# EasyEDA schematic SCH_mgts_sensor_node_2026-06-15.json
TITLE: Sheet_1; REV: 1.0; Date: 2026-06-06; Sheet: 1/1; Drawn By: u.s.pat1234; Company: Your Company
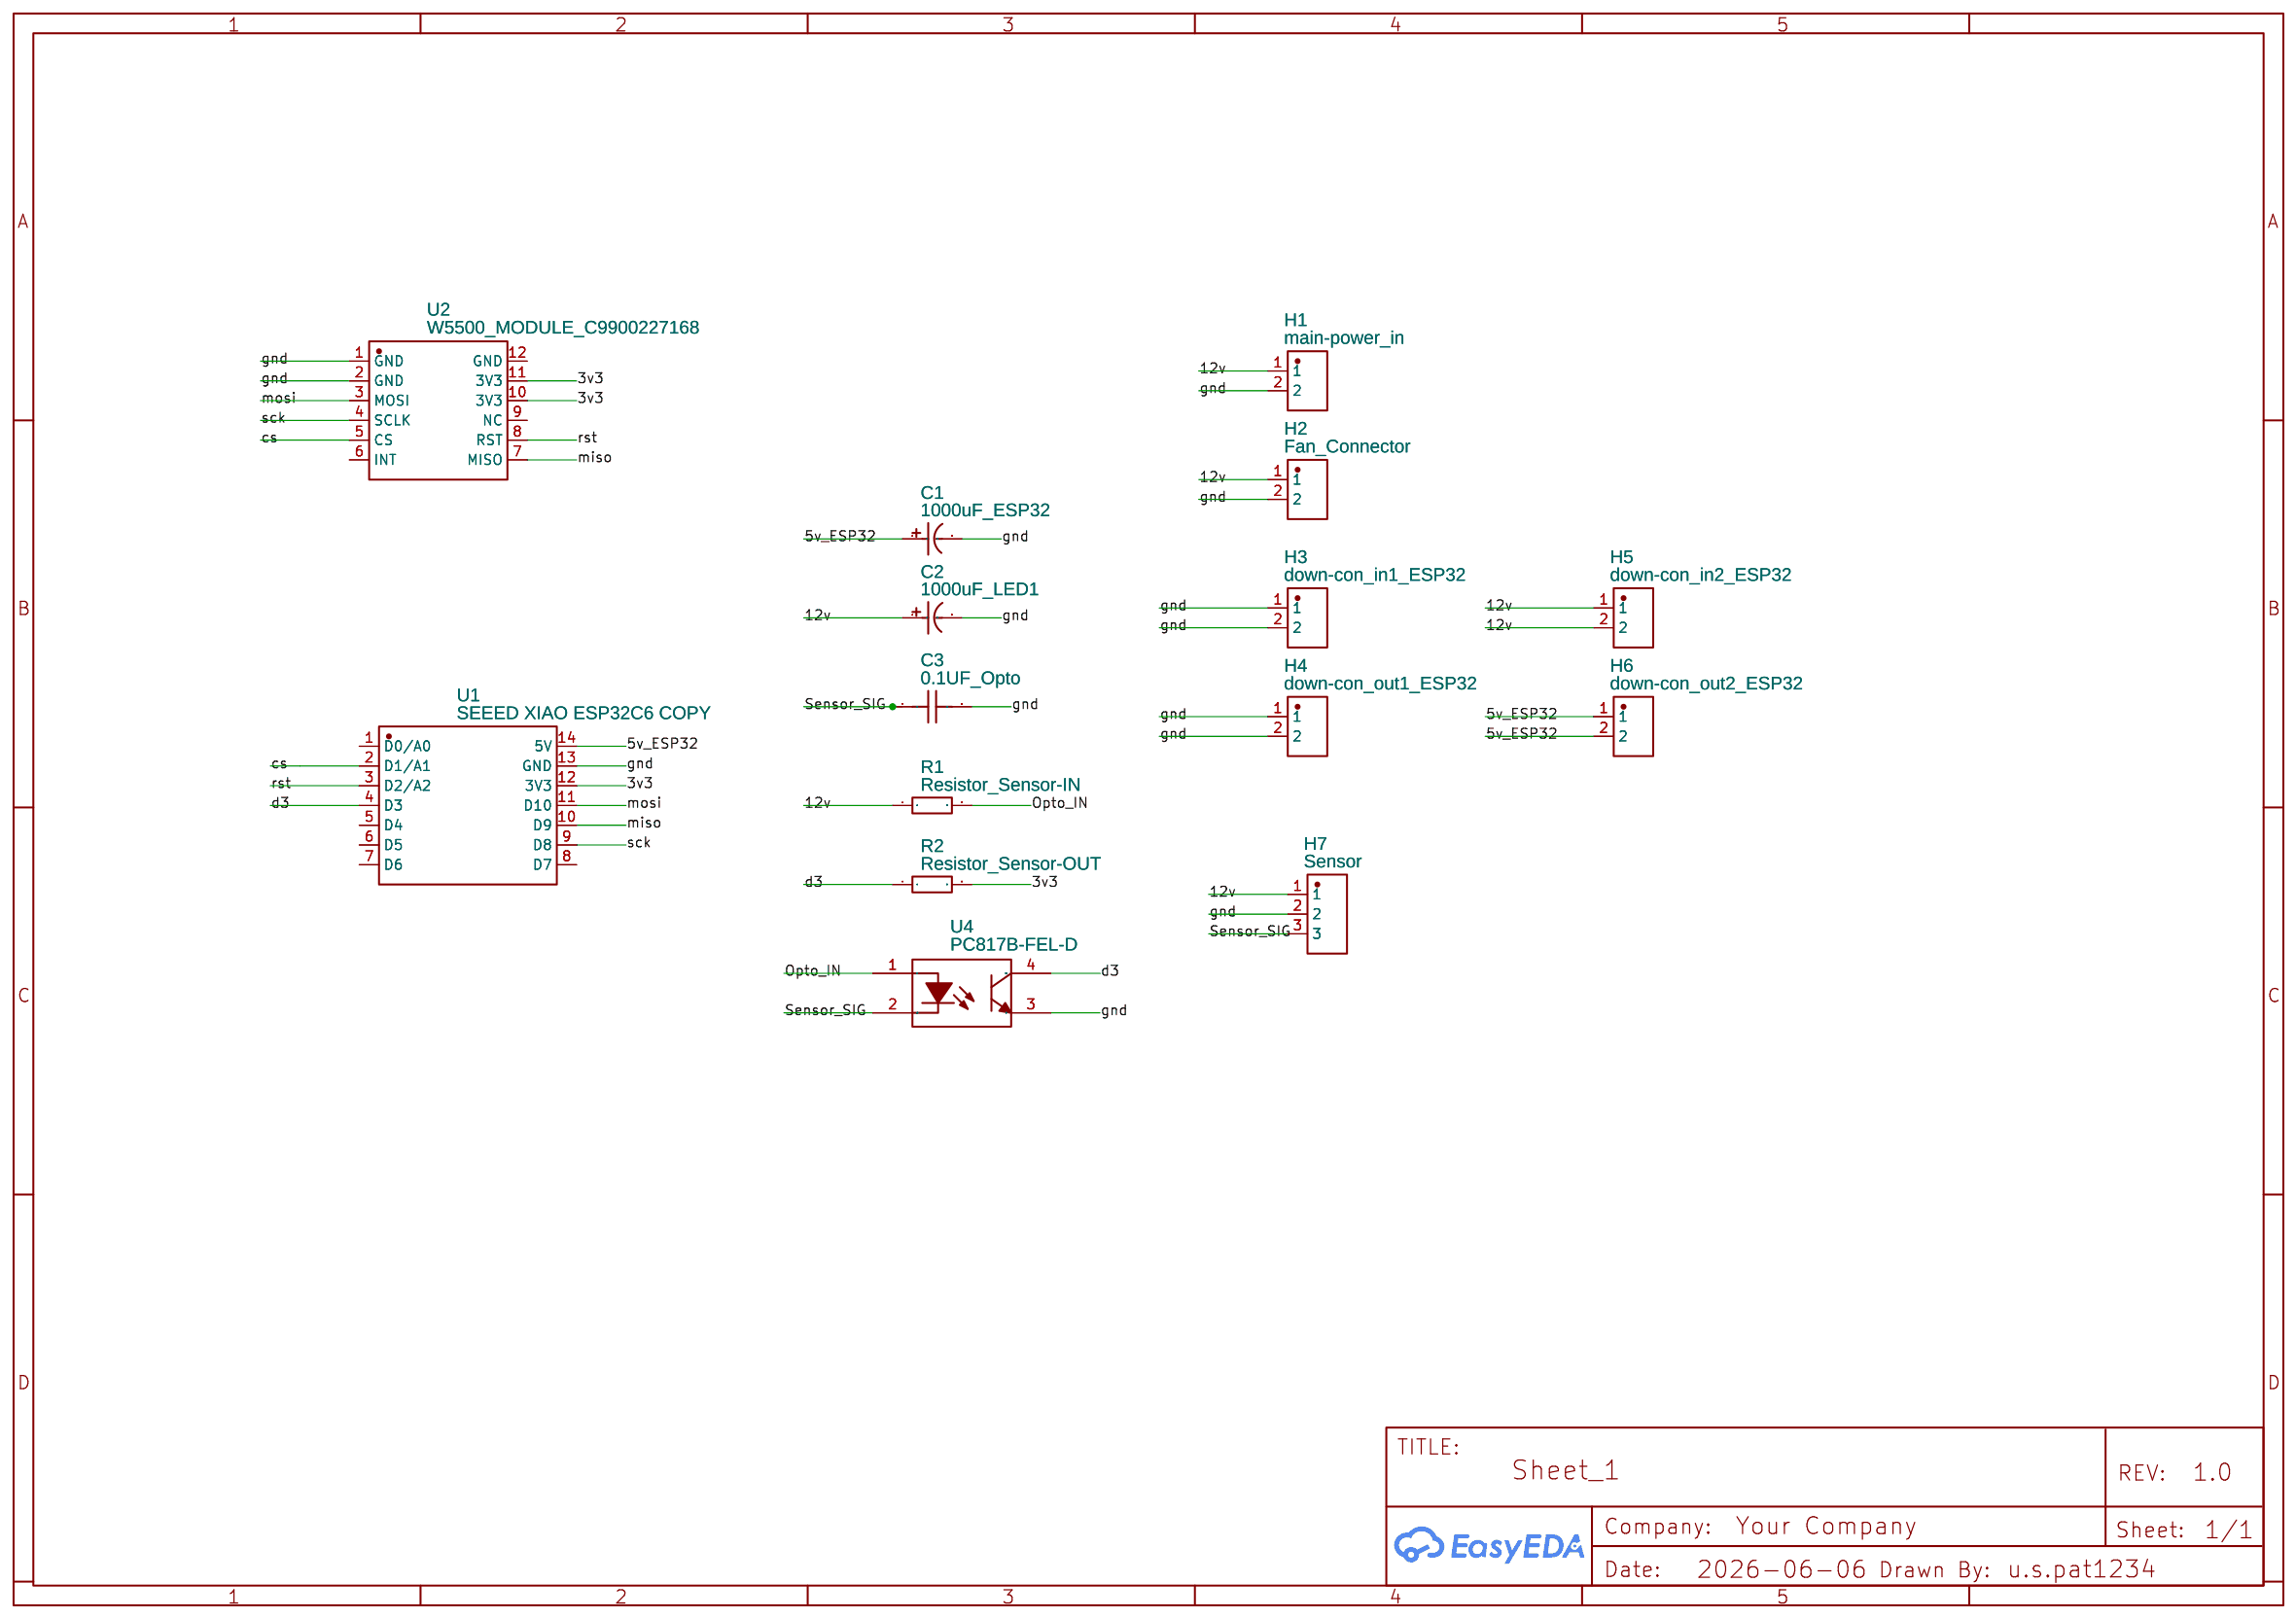
[diagram p0: schematic sheet]

## Parts
C1  1000uF_ESP32  [1000UF 25V ELECTROLYTIC]
C2  1000uF_LED1  [1000UF 25V ELECTROLYTIC]
C3  0.1UF_Opto  [CAP-TH_L10.0-W4.5-P7.50-D0.6]
H1  main-power_in  [HDR-TH_2P-P2.54-H-M_KH-2.54PH90-1X2P-L13.8]
H2  Fan_Connector  [HDR-TH_2P-P2.54-H-M_KH-2.54PH90-1X2P-L13.8]
H3  down-con_in1_ESP32  [HDR-TH_2P-P2.54-H-M_KH-2.54PH90-1X2P-L13.8]
H4  down-con_out1_ESP32  [HDR-TH_2P-P2.54-H-M_KH-2.54PH90-1X2P-L13.8]
H5  down-con_in2_ESP32  [HDR-TH_2P-P2.54-H-M_KH-2.54PH90-1X2P-L13.8]
H6  down-con_out2_ESP32  [HDR-TH_2P-P2.54-H-M_KH-2.54PH90-1X2P-L13.8]
H7  Sensor  [HDR-TH_XY-2.54-1X3PZ]
R1  Resistor_Sensor-IN  [RES-TH_BD3.2-L9.0-P13.00-D0.5]
R2  Resistor_Sensor-OUT  [RES-TH_BD3.2-L9.0-P13.00-D0.5]
U1  SEEED XIAO ESP32C6 COPY  [ESP32C6 XIAO]
U2  W5500_MODULE_C9900227168  [COMM-TH_L25.0-W23.0_W5500_MODULE]
U4  PC817B-FEL-D  [DIP-4_L6.5-W4.6-P2.54-LS7.6-BL]

## Library data of the parts
C1 C2 = 1000uF: Contributor: matko123
C3 = 250V 0.1UF 5% CBBCapacitor: Supplier: LCSC; Manufacturer: ReliaPro; Supplier Part: C46804; JLCPCB Part Class: Extended Part
H1-H6 = KH-2.54PH90-1X2P-L13.8: Contributor: LCSC; Supplier: LCSC; Supplier Part: C2905424; Manufacturer: kinghelm(金航标); JLCPCB Part Class: Extended Part
H7 = XY-2.54-1*3PZ: Supplier: LCSC; Supplier Part: C54110157; Manufacturer: XYECONN(辛译); JLCPCB Part Class: Extended Part; Contributor: lcsc
R1 R2 = 1K-AXIAL-0.4: Contributor: lcsc; Supplier: LCSC; Supplier Part: C9900024064; Manufacturer: null; JLCPCB Part Class: Extended Part
U1 = SEEED XIAO ESP32C6 COPY: Manufacturer: Seeed Studio; Manufacturer Part: XIAO ESP32C6; link: https://wiki.seeedstudio.com/xiao_esp32c6_getting_started/; Contributor: parker4955
U2 = W5500_MODULE_C9900227168: Supplier: LCSC; Supplier Part: C9900227168; Manufacturer: null; Manufacturer Part: W5500_MODULE; JLCPCB Part Class: Extended Part; Contributor: lcsc
U4 = PC817B-FEL-D: Supplier: LCSC; Supplier Part: C50229498; Manufacturer: DDF(鼎德丰); Contributor: lcsc; JLCPCB Part Class: Extended Part

## Nets
3v3: R2.2 U1.12(3V3) U2.10(3V3) U2.11(3V3)
5v_ESP32: C1.1 H6.1 H6.2 U1.14(5V)
12v: C2.1 H1.1 H2.1 H5.1 H5.2 H7.1 R1.1
gnd: C1.2 C2.2 C3.2 H1.2 H2.2 H3.1 H3.2 H4.1 H4.2 H7.2 U1.13(GND) U2.1(GND) U2.2(GND) U4.3(EM)
cs: U1.2(D1/A1) U2.5(CS)
d3: R2.1 U1.4(D3) U4.4(COL)
miso: U1.10(D9) U2.7(MISO)
mosi: U1.11(D10) U2.3(MOSI)
Opto_IN: R1.2 U4.1(AN)
rst: U1.3(D2/A2) U2.8(RST)
sck: U1.9(D8) U2.4(SCLK)
Sensor_SIG: C3.1 H7.3 U4.2(CAT)

Not connected (* = marked no-connect by the designer): U1 1(D0/A0) 5(D4) 6(D5) 7(D6) 8(D7); U2 6(INT) 9(NC) 12(GND)
